# Altium schematic sheet Sheet_1_2021-01-19 (1).schdoc
size 49 x 58 mm
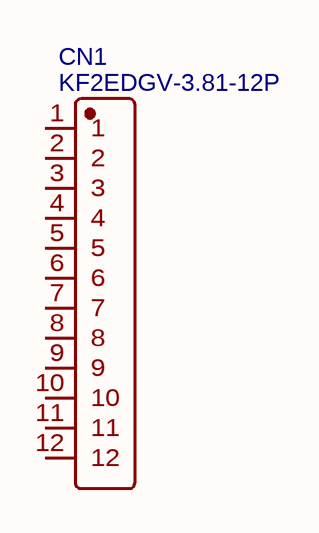
[diagram p0: Sheet_1_2021-01-19 (1).schdoc]

## Parts
CN1  KF2EDGV-3.81-12P  [CONN-TH_12P-P3.81_KF2EDGV-3.81-12P]

## Nets

Not connected (* = marked no-connect by the designer): CN1 1 2 3 4 5 6 7 8 9 10 11 12

## Library data of the parts
CN1 = KF2EDGV-3.81-12P: BOM_Manufacturer: Cixi Kefa Elec; Contributor: LCSC; SMT Type: Extend; BOM_Supplier: LCSC; BOM_Supplier Part: C441330; BOM_Manufacturer Part: KF2EDGV-3.81-12P; BOM_JLCPCB SMD: Yes; spicePre: C; spiceSymbolName: KF2EDGV-3.81-12P